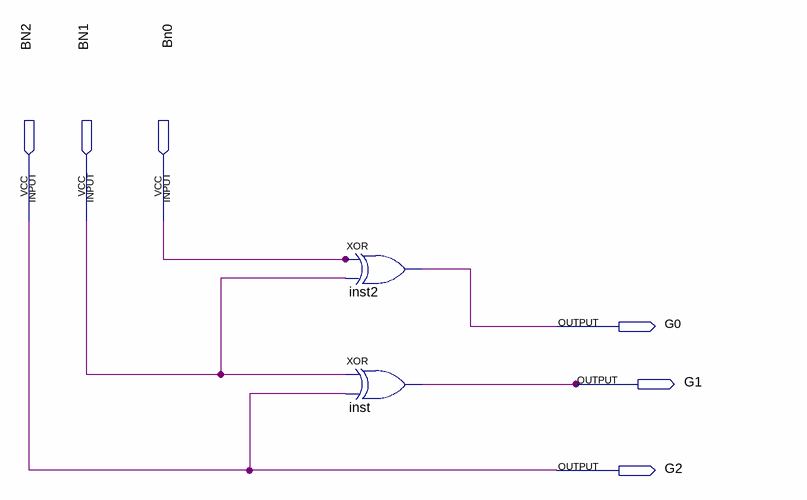
[diagram p0: schematic sheet]
// Quartus schematic Converter.bdf as structural Verilog: 2 symbols, 6 pins
module Converter (
  input  BN2,
  input  BN1,
  input  Bn0,
  output G0,
  output G1,
  output G2
);

  xor inst2 (G0, Bn0, BN1);
  xor inst (G1, BN1, BN2);

  assign G2 = BN2;
endmodule
